# Altium schematic sheet S04.SchDoc: Quad Linear Amplifier
size 381 x 254 mm; Revision: 1.6; SheetNumber: 4; SheetTotal: 9
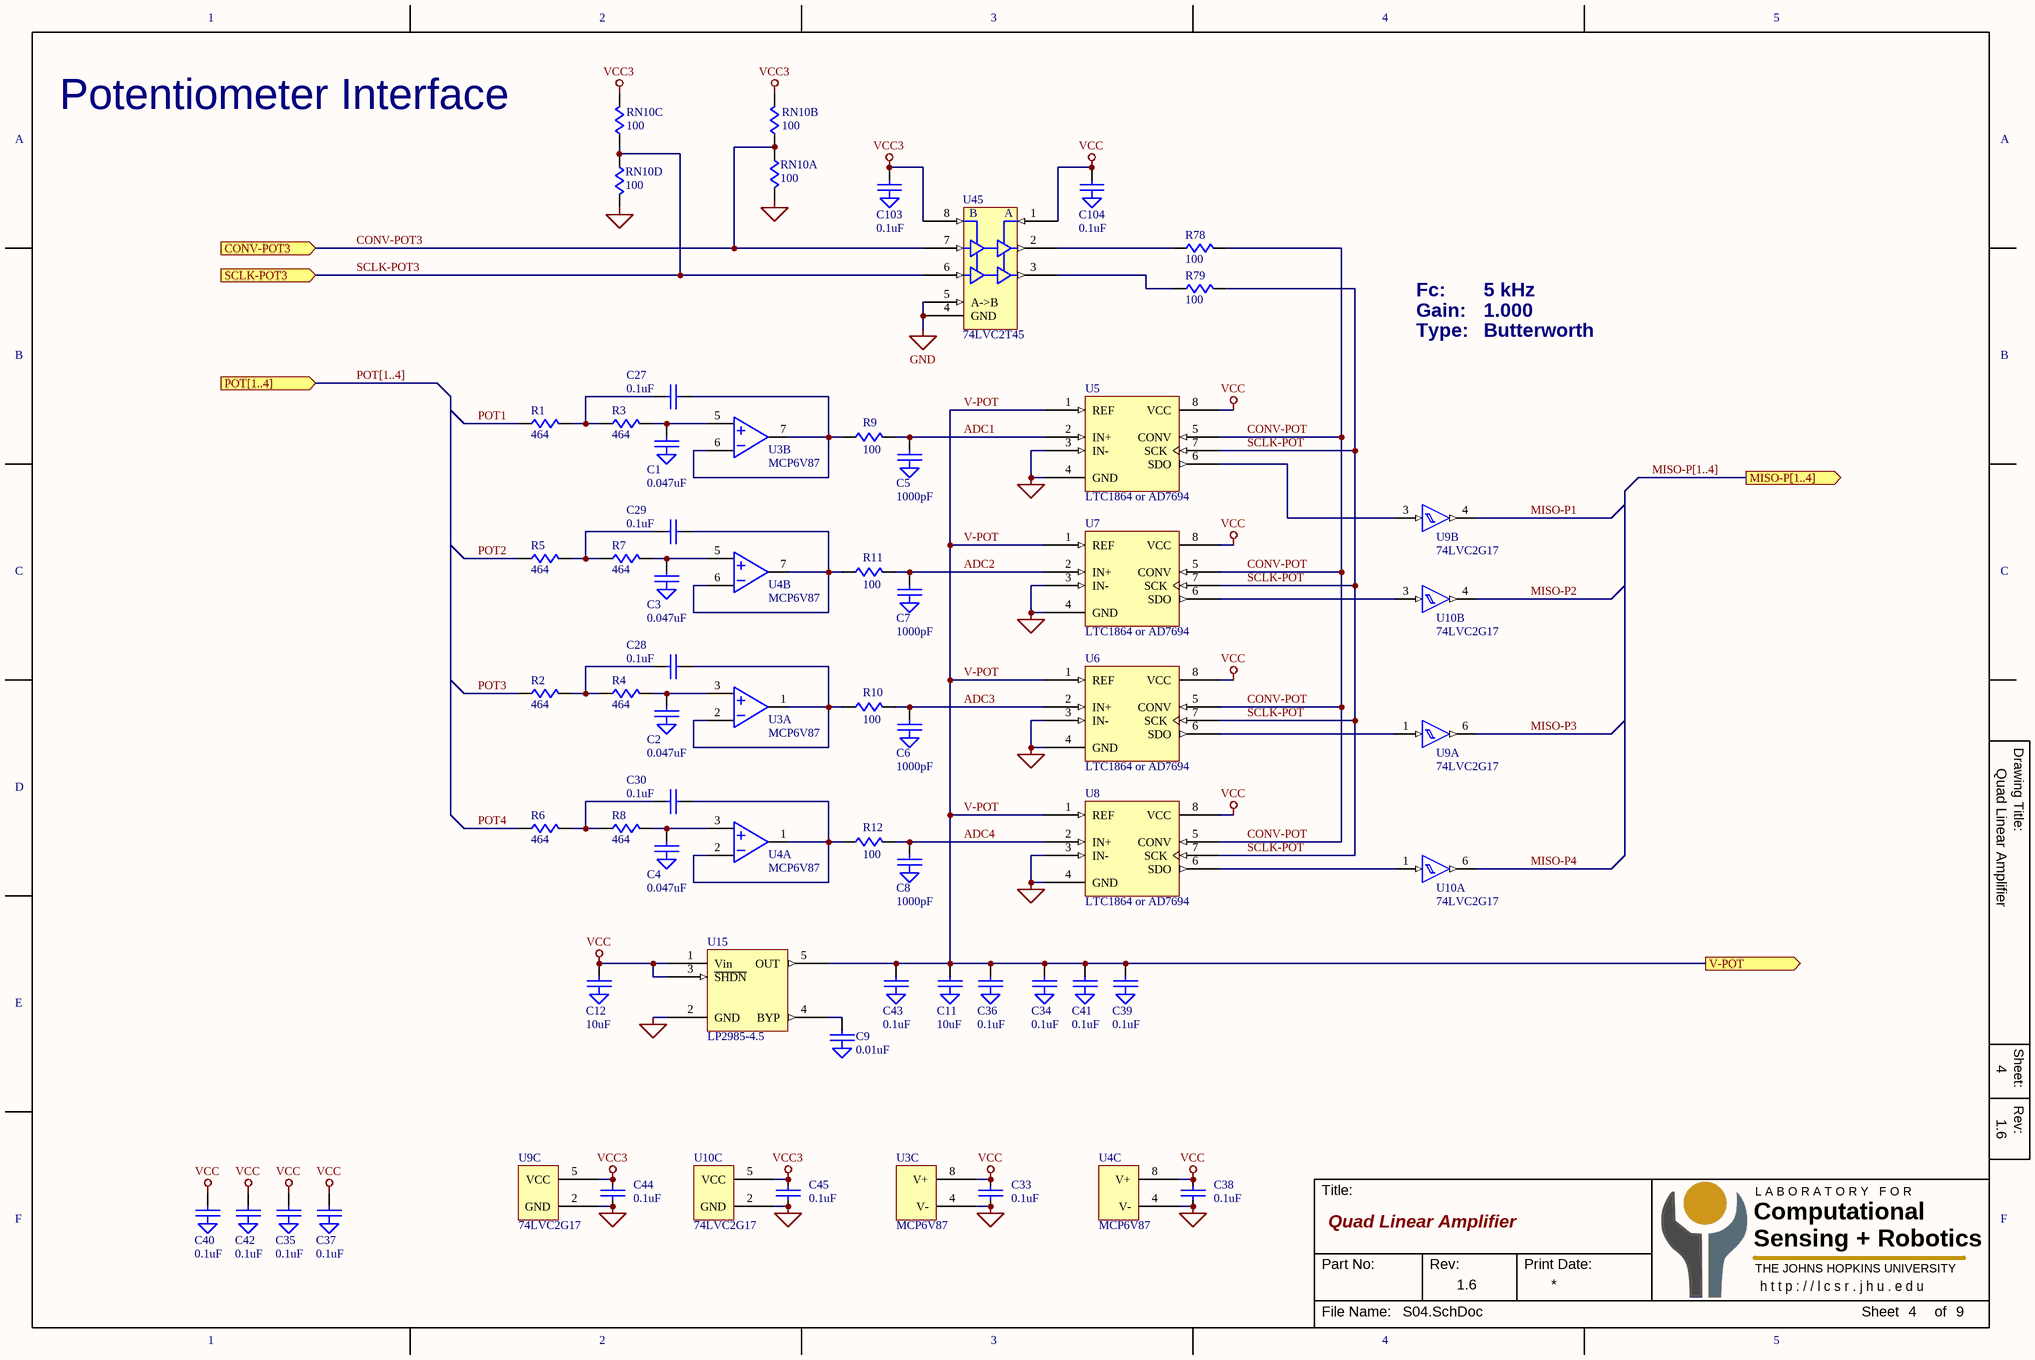
[diagram p0: S04.SchDoc]

## Parts
C1  0.047uF  [C0603]
C2  0.047uF  [C0603]
C3  0.047uF  [C0603]
C4  0.047uF  [C0603]
C5  1000pF  [C0603]
C6  1000pF  [C0603]
C7  1000pF  [C0603]
C8  1000pF  [C0603]
C9  0.01uF  [C0603]
C11  10uF  [C0603]
C12  10uF  [C0603]
C27  0.1uF  [C0603]
C28  0.1uF  [C0603]
C29  0.1uF  [C0603]
C30  0.1uF  [C0603]
C33  0.1uF  [C0603]
C34  0.1uF  [C0603]
C35  0.1uF  [C0603]
C36  0.1uF  [C0603]
C37  0.1uF  [C0603]
C38  0.1uF  [C0603]
C39  0.1uF  [C0603]
C40  0.1uF  [C0603]
C41  0.1uF  [C0603]
C42  0.1uF  [C0603]
C43  0.1uF  [C0603]
C44  0.1uF  [C0603]
C45  0.1uF  [C0603]
C103  0.1uF  [C0603]
C104  0.1uF  [C0603]
R1  464  [R0603]
R2  464  [R0603]
R3  464  [R0603]
R4  464  [R0603]
R5  464  [R0603]
R6  464  [R0603]
R7  464  [R0603]
R8  464  [R0603]
R9  100  [R0603]
R10  100  [R0603]
R11  100  [R0603]
R12  100  [R0603]
R78  100  [R0603]
R79  100  [R0603]
RN10  100  [RN-742C083]  (parts A,B,C,D of 4)
U3  MCP6V87  [MSOP-8]  (parts A,B,C of 3)
U4  MCP6V87  [MSOP-8]  (parts A,B,C of 3)
U5  LTC1864 or AD7694  [MSOP-8]
U6  LTC1864 or AD7694  [MSOP-8]
U7  LTC1864 or AD7694  [MSOP-8]
U8  LTC1864 or AD7694  [MSOP-8]
U9  74LVC2G17  [SOT-23-6]  (parts A,B,C of 3)
U10  74LVC2G17  [SOT-23-6]  (parts A,B,C of 3)
U15  LP2985-4.5  [SOT-23-5]
U45  74LVC2T45  [US8-8]

## Ports
CONV-POT3 (in), MISO-P[1..4] (out), POT[1..4] (in), SCLK-POT3 (in), V-POT (out)

## Nets
GND: C1.2(GND) C2.2(GND) C3.2(GND) C4.2(GND) C5.2(GND) C6.2(GND) C7.2(GND) C8.2(GND) C9.2(GND) C11.2(GND) C12.2(GND) C33.2 C34.2(GND) C35.2(GND) C36.2(GND) C37.2(GND) C38.2 C39.2(GND) C40.2(GND) C41.2(GND) C42.2(GND) C43.2(GND) C44.2 C45.2 C103.2(GND) C104.2(GND) RN10.5 RN10.8 U3.4(V-) U4.4(V-) U5.3(IN-) U5.4(GND) U6.3(IN-) U6.4(GND) U7.3(IN-) U7.4(GND) U8.3(IN-) U8.4(GND) U9.2(GND) U10.2(GND) U15.2(GND) U45.4(GND) U45.5(A->B)
VCC: C12.1 C33.1 C35.1 C37.1 C38.1 C40.1 C42.1 C104.1 U3.8(V+) U4.8(V+) U5.8(VCC) U6.8(VCC) U7.8(VCC) U8.8(VCC) U15.1(Vin) U15.3(~{SHDN}) U45.1(VCCA)
VCC3: C44.1 C45.1 C103.1 RN10.6 RN10.7 U9.5(VCC) U10.5(VCC) U45.8(VCCB)
ADC1: C5.1 R9.2 U5.2(IN+)
ADC2: C7.1 R11.2 U7.2(IN+)
ADC3: C6.1 R10.2 U6.2(IN+)
ADC4: C8.1 R12.2 U8.2(IN+)
CONV-POT: R78.2 U5.5(CONV) U6.5(CONV) U7.5(CONV) U8.5(CONV)
CONV-POT3: RN10.1 RN10.2 U45.7(B) ; port CONV-POT3
MISO-P1: U9.4
MISO-P2: U10.4
MISO-P3: U9.6
MISO-P4: U10.6
POT1: R1.1
POT2: R5.1
POT3: R2.1
POT4: R6.1
SCLK-POT: R79.2 U5.7(SCK) U6.7(SCK) U7.7(SCK) U8.7(SCK)
SCLK-POT3: RN10.3 RN10.4 U45.6(B) ; port SCLK-POT3
V-POT: C11.1 C34.1 C36.1 C39.1 C41.1 C43.1 U5.1(REF) U6.1(REF) U7.1(REF) U8.1(REF) U15.5(OUT) ; port V-POT
NetC1_1: C1.1 R3.2 U3.5(IN+)
NetC2_1: C2.1 R4.2 U3.3(IN+)
NetC3_1: C3.1 R7.2 U4.5(IN+)
NetC4_1: C4.1 R8.2 U4.3(IN+)
NetC9_1: C9.1 U15.4(BYP)
NetC27_1: C27.1 R1.2 R3.1
NetC27_2: C27.2 R9.1 U3.6(IN-) U3.7(O)
NetC28_1: C28.1 R2.2 R4.1
NetC28_2: C28.2 R10.1 U3.1(O) U3.2(IN-)
NetC29_1: C29.1 R5.2 R7.1
NetC29_2: C29.2 R11.1 U4.6(IN-) U4.7(O)
NetC30_1: C30.1 R6.2 R8.1
NetC30_2: C30.2 R12.1 U4.1(O) U4.2(IN-)
NetR78_1: R78.1 U45.2(A)
NetR79_1: R79.1 U45.3(A)
NetU5_6: U5.6(SDO) U9.3
NetU6_6: U6.6(SDO) U9.1
NetU7_6: U7.6(SDO) U10.3
NetU8_6: U8.6(SDO) U10.1

## Buses and harness runs
bus MISO-P[1..4] = port MISO-P[1..4]
bus POT[1..4] = port POT[1..4]

## Notes on the sheet
- Potentiometer Interface
- Fc:
- 5 kHz
- Gain:
- Type:
- 1.000
- Butterworth
- 1
- 2
- 3
- 4
- 5
- A
- B
- C
- Drawing Title:
- D
- E
- Sheet:
- Rev:
- F
- Title:
- Computational
- Sensing + Robotics
- L A B O R A T O R Y   F O R
- Part No:
- Print Date:
- THE JOHNS HOPKINS UNIVERSITY
- h t t p : / / l c s r . j h u . e d u
- File Name:
- Sheet
- of

## Library data of the parts
C1-C9 C11 C12 C34-C37 C39-C43 C103 C104 = CAP-GND
C27-C30 = CAP
C33 C38 C44 C45 = CAP-MINI
R1-R12 R78 R79 = R
RN10 = RN-DISC-SM-4X
U3 U4 = OPAMP-DUAL-PWR-MINI
U5-U8 = LTC1864
U9 U10 = 2G17: NC7WZ17
U15 = LP2985